# Altium schematic sheet 17 MIPI_CSI_RX.SchDoc: CM4 IO
size 420 x 297 mm; Page Create Date: March  8, 1995; Page Number: 17; Page Size: A3; Comment: radxa_1010; Page Count: 19; RevCode: V1.10; Doc: 17 MIPI_CSI_RX; DsnPath: D:\WMS\黄工\[RC126]CM4_IO_V1.10\[RC126]_V1.10\CM4 IO_V1.10.DSN; SchematicName: CM4 IO V1.10; PageName: 17 MIPI_CSI_RX; PageSize: A3; TopSchematic: True
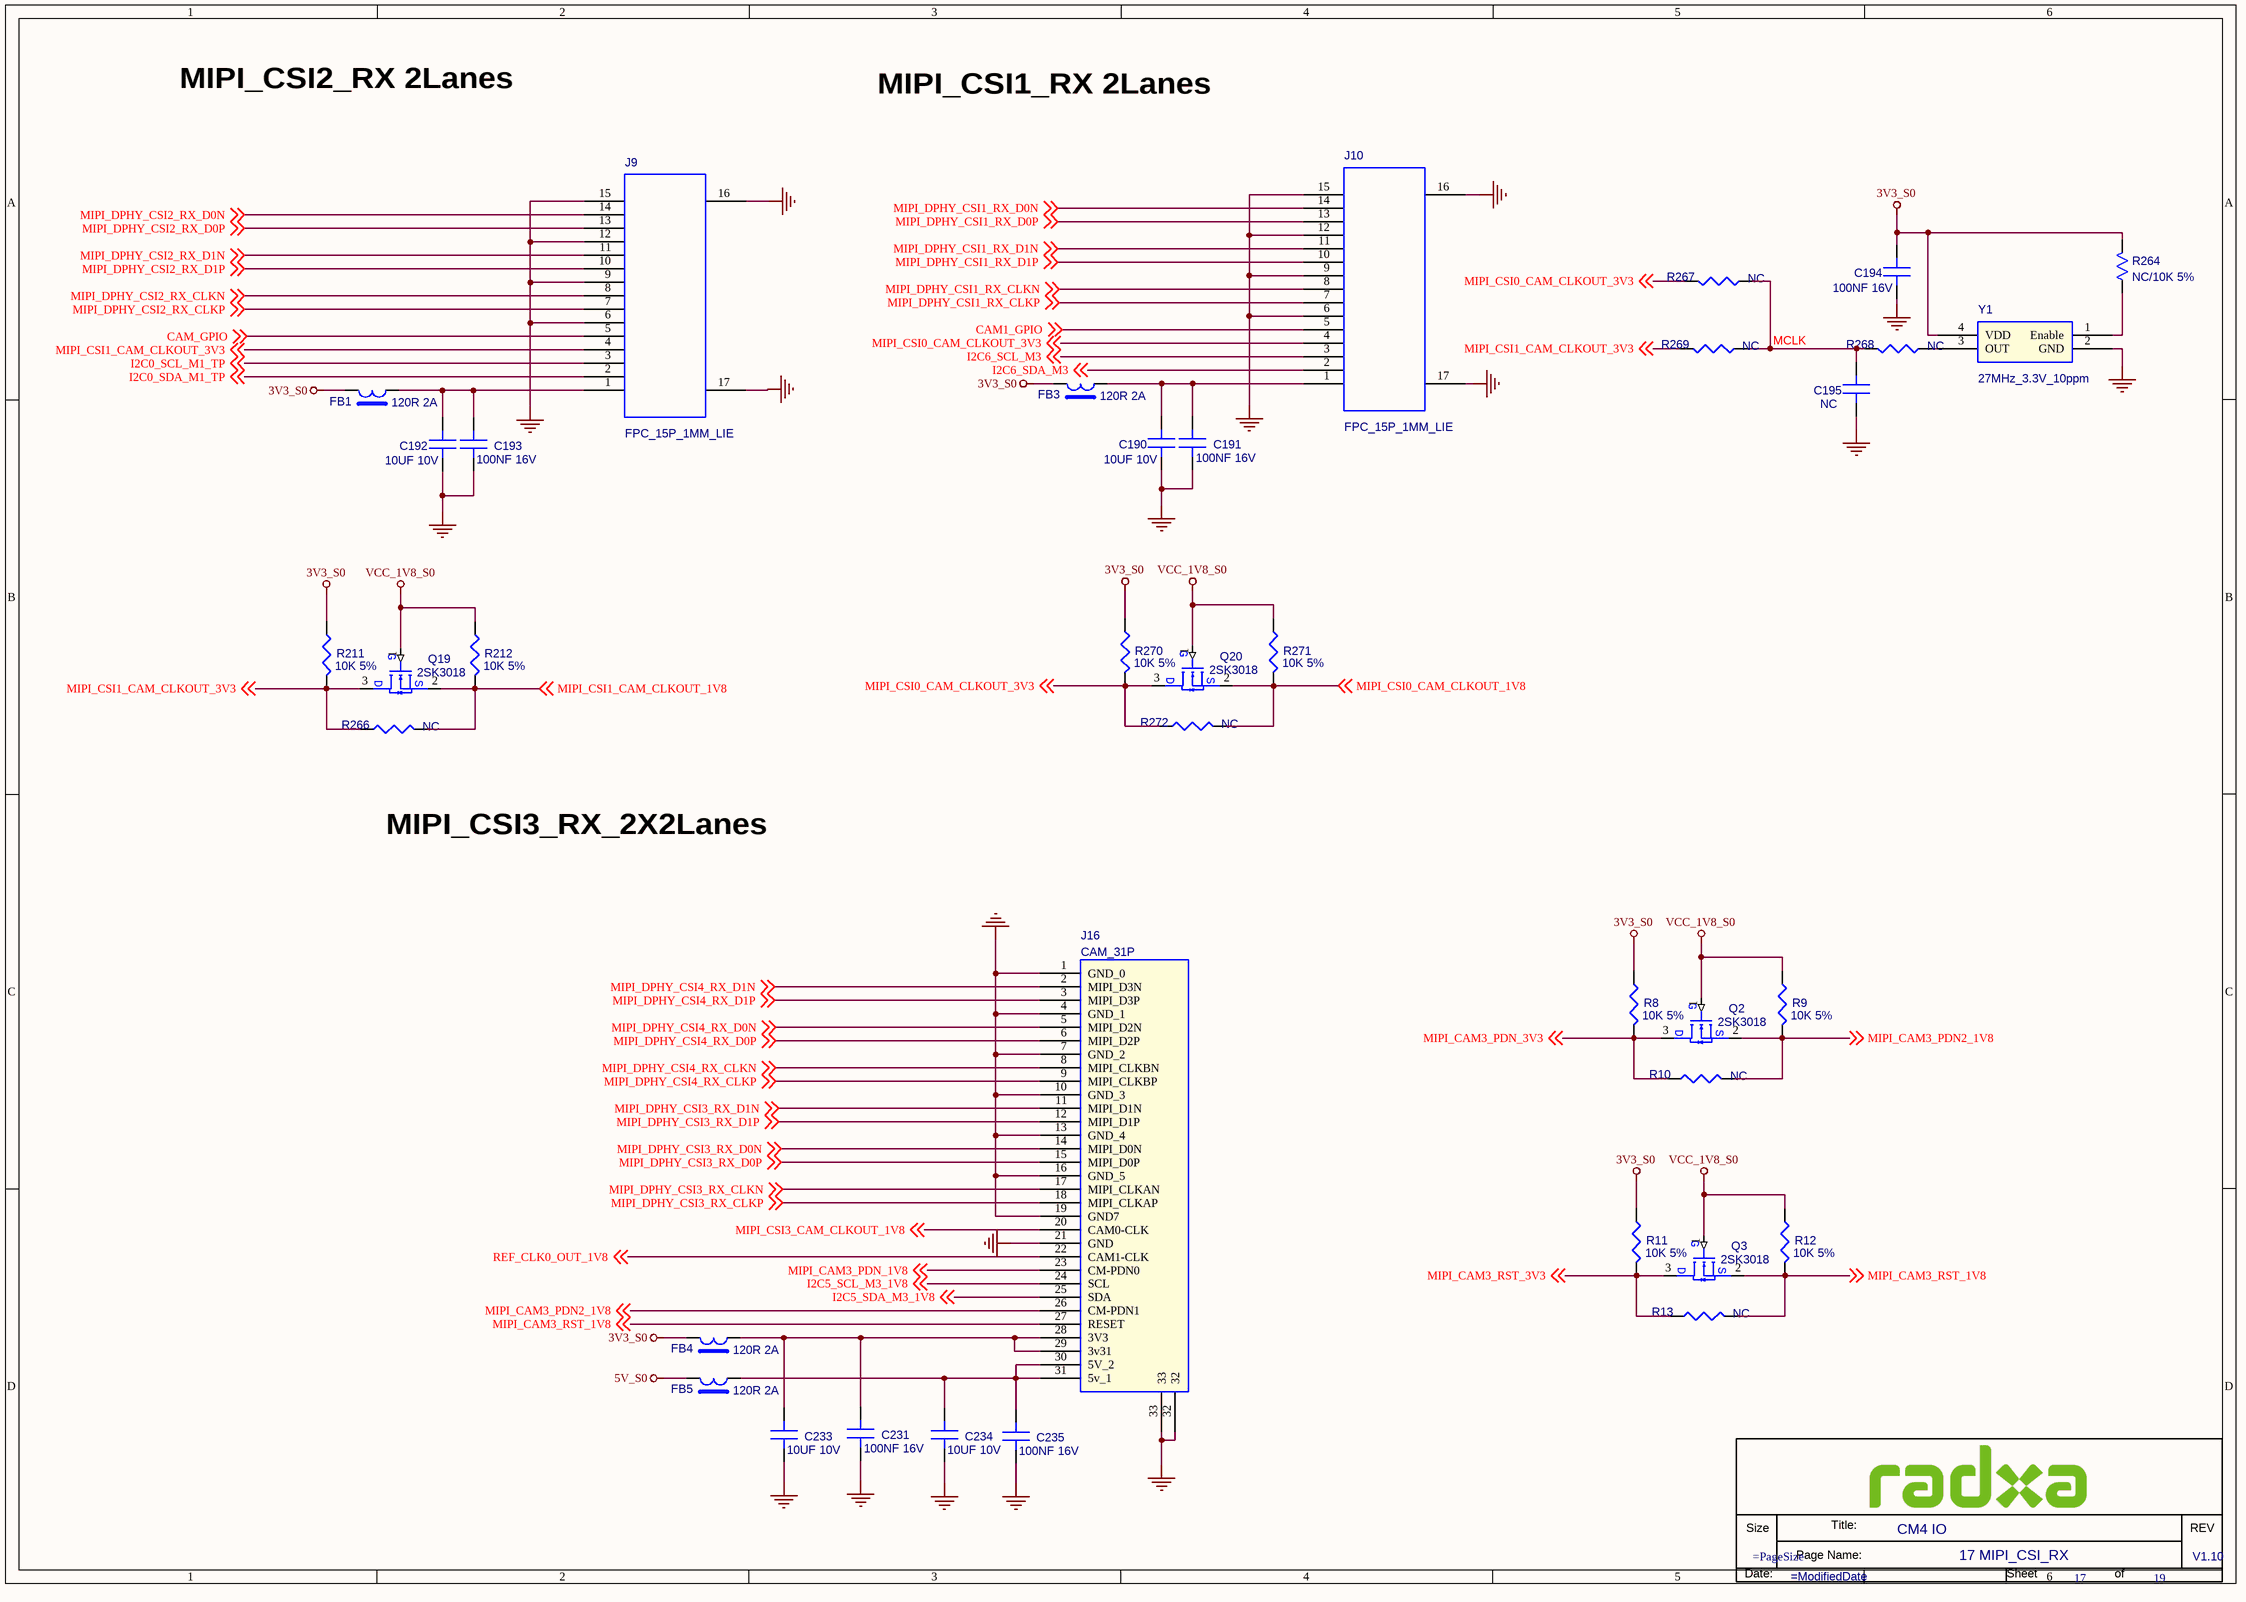
[diagram p0: 17 MIPI_CSI_RX.SchDoc]

## Parts
*  Doc: 17 MIPI_CSI_RX  RevCode: V1.10  Title: CM4 IO  Page Number: 17  Page Count: 19  (hidden comment: radxa_1010)  (graphical)
C190  10UF 10V  [C0402]
C191  100NF 16V  [C0201]
C192  10UF 10V  [C0402]
C193  100NF 16V  [C0201]
C194  100NF 16V  [C0201]
C195  NC  [C0201]
C231  100NF 16V  [C0201]
C233  10UF 10V  [C0402]
C234  10UF 10V  [C0402]
C235  100NF 16V  [C0201]
FB1  120R 2A  [FB0402]
FB3  120R 2A  [FB0402]
FB4  120R 2A  [FB0402]
FB5  120R 2A  [FB0402]
J9  FPC_15P_1MM_LIE  [FPC_15_1D0_LIE]
J10  FPC_15P_1MM_LIE  [FPC_15_1D0_LIE]
J16  CAM_31P  [FPC_31P_0d3_LIE]
Q2  2SK3018  [SOT_323]
Q3  2SK3018  [SOT_323]
Q19  2SK3018  [SOT_323]
Q20  2SK3018  [SOT_323]
R8  10K 5%  [R0402]
R9  10K 5%  [R0402]
R10  NC  [R0402]
R11  10K 5%  [R0402]
R12  10K 5%  [R0402]
R13  NC  [R0402]
R211  10K 5%  [R0402]
R212  10K 5%  [R0402]
R264  NC/10K 5%  [R0201]
R266  NC  [R0402]
R267  NC  [R0402]
R268  NC  [R0402]
R269  NC  [R0402]
R270  10K 5%  [R0402]
R271  10K 5%  [R0402]
R272  NC  [R0402]
Y1  27MHz_3.3V_10ppm  [Y-4-5_08-TXC-7W5]

## Nets
3V3_S0: C194.1 FB1.2 FB3.2 FB4.2 R8.2 R11.2 R211.2 R264.2 R270.2 Y1.4(VDD)
5V_S0: FB5.2
GND: C190.2(B) C191.2(B) C192.2(B) C193.2(B) C194.2 C195.2 C231.2(B) C233.2(B) C234.2(B) C235.2(B) J9.6 J9.9 J9.12 J9.15 J9.16 J9.17 J10.6 J10.9 J10.12 J10.15 J10.16 J10.17 J16.1(GND_0) J16.4(GND_1) J16.7(GND_2) J16.10(GND_3) J16.13(GND_4) J16.16(GND_5) J16.19(GND7) J16.21(GND) J16.32 J16.33 Y1.2(GND)
VCC_1V8_S0: Q2.1(G) Q3.1(G) Q19.1(G) Q20.1(G) R9.2 R12.2 R212.2 R271.2
CAM1_GPIO: J10.5 ; off-sheet CAM1_GPIO
CAM_GPIO: J9.5 ; off-sheet CAM_GPIO
I2C0_SCL_M1_TP: J9.3 ; off-sheet I2C0_SCL_M1_TP
I2C0_SDA_M1_TP: J9.2 ; off-sheet I2C0_SDA_M1_TP
I2C5_SCL_M3_1V8: J16.24(SCL) ; off-sheet I2C5_SCL_M3_1V8
I2C5_SDA_M3_1V8: J16.25(SDA) ; off-sheet I2C5_SDA_M3_1V8
I2C6_SCL_M3: J10.3 ; off-sheet I2C6_SCL_M3
I2C6_SDA_M3: J10.2 ; off-sheet I2C6_SDA_M3
MCLK: C195.1 R267.1 R268.1 R269.1
MIPI_CAM3_PDN2_1V8: J16.26(CM-PDN1) Q2.2(S) R9.1 R10.1 ; off-sheet MIPI_CAM3_PDN2_1V8
MIPI_CAM3_PDN_1V8: J16.23(CM-PDN0) ; off-sheet MIPI_CAM3_PDN_1V8
MIPI_CAM3_PDN_3V3: Q2.3(D) R8.1 R10.2 ; off-sheet MIPI_CAM3_PDN_3V3
MIPI_CAM3_RST_1V8: J16.27(RESET) Q3.2(S) R12.1 R13.1 ; off-sheet MIPI_CAM3_RST_1V8
MIPI_CAM3_RST_3V3: Q3.3(D) R11.1 R13.2 ; off-sheet MIPI_CAM3_RST_3V3
MIPI_CSI0_CAM_CLKOUT_1V8: Q20.2(S) R271.1 R272.1 ; off-sheet MIPI_CSI0_CAM_CLKOUT_1V8
MIPI_CSI0_CAM_CLKOUT_3V3: J10.4 Q20.3(D) R267.2 R270.1 R272.2 ; off-sheet MIPI_CSI0_CAM_CLKOUT_3V3
MIPI_CSI1_CAM_CLKOUT_1V8: Q19.2(S) R212.1 R266.1 ; off-sheet MIPI_CSI1_CAM_CLKOUT_1V8
MIPI_CSI1_CAM_CLKOUT_3V3: J9.4 Q19.3(D) R211.1 R266.2 R269.2 ; off-sheet MIPI_CSI1_CAM_CLKOUT_3V3
MIPI_CSI3_CAM_CLKOUT_1V8: J16.20(CAM0-CLK) ; off-sheet MIPI_CSI3_CAM_CLKOUT_1V8
MIPI_DPHY_CSI1_RX_CLKN: J10.8 ; off-sheet MIPI_DPHY_CSI1_RX_CLKN
MIPI_DPHY_CSI1_RX_CLKP: J10.7 ; off-sheet MIPI_DPHY_CSI1_RX_CLKP
MIPI_DPHY_CSI1_RX_D0N: J10.14 ; off-sheet MIPI_DPHY_CSI1_RX_D0N
MIPI_DPHY_CSI1_RX_D0P: J10.13 ; off-sheet MIPI_DPHY_CSI1_RX_D0P
MIPI_DPHY_CSI1_RX_D1N: J10.11 ; off-sheet MIPI_DPHY_CSI1_RX_D1N
MIPI_DPHY_CSI1_RX_D1P: J10.10 ; off-sheet MIPI_DPHY_CSI1_RX_D1P
MIPI_DPHY_CSI2_RX_CLKN: J9.8 ; off-sheet MIPI_DPHY_CSI2_RX_CLKN
MIPI_DPHY_CSI2_RX_CLKP: J9.7 ; off-sheet MIPI_DPHY_CSI2_RX_CLKP
MIPI_DPHY_CSI2_RX_D0N: J9.14 ; off-sheet MIPI_DPHY_CSI2_RX_D0N
MIPI_DPHY_CSI2_RX_D0P: J9.13 ; off-sheet MIPI_DPHY_CSI2_RX_D0P
MIPI_DPHY_CSI2_RX_D1N: J9.11 ; off-sheet MIPI_DPHY_CSI2_RX_D1N
MIPI_DPHY_CSI2_RX_D1P: J9.10 ; off-sheet MIPI_DPHY_CSI2_RX_D1P
MIPI_DPHY_CSI3_RX_CLKN: J16.17(MIPI_CLKAN) ; off-sheet MIPI_DPHY_CSI3_RX_CLKN
MIPI_DPHY_CSI3_RX_CLKP: J16.18(MIPI_CLKAP) ; off-sheet MIPI_DPHY_CSI3_RX_CLKP
MIPI_DPHY_CSI3_RX_D0N: J16.14(MIPI_D0N) ; off-sheet MIPI_DPHY_CSI3_RX_D0N
MIPI_DPHY_CSI3_RX_D0P: J16.15(MIPI_D0P) ; off-sheet MIPI_DPHY_CSI3_RX_D0P
MIPI_DPHY_CSI3_RX_D1N: J16.11(MIPI_D1N) ; off-sheet MIPI_DPHY_CSI3_RX_D1N
MIPI_DPHY_CSI3_RX_D1P: J16.12(MIPI_D1P) ; off-sheet MIPI_DPHY_CSI3_RX_D1P
MIPI_DPHY_CSI4_RX_CLKN: J16.8(MIPI_CLKBN) ; off-sheet MIPI_DPHY_CSI4_RX_CLKN
MIPI_DPHY_CSI4_RX_CLKP: J16.9(MIPI_CLKBP) ; off-sheet MIPI_DPHY_CSI4_RX_CLKP
MIPI_DPHY_CSI4_RX_D0N: J16.5(MIPI_D2N) ; off-sheet MIPI_DPHY_CSI4_RX_D0N
MIPI_DPHY_CSI4_RX_D0P: J16.6(MIPI_D2P) ; off-sheet MIPI_DPHY_CSI4_RX_D0P
MIPI_DPHY_CSI4_RX_D1N: J16.2(MIPI_D3N) ; off-sheet MIPI_DPHY_CSI4_RX_D1N
MIPI_DPHY_CSI4_RX_D1P: J16.3(MIPI_D3P) ; off-sheet MIPI_DPHY_CSI4_RX_D1P
REF_CLK0_OUT_1V8: J16.22(CAM1-CLK) ; off-sheet REF_CLK0_OUT_1V8
NetC190_1: C190.1(A) C191.1(A) FB3.1 J10.1
NetC192_1: C192.1(A) C193.1(A) FB1.1 J9.1
NetC231_1: C231.1(A) C233.1(A) FB4.1 J16.28(3V3) J16.29(3v31)
NetC234_1: C234.1(A) C235.1(A) FB5.1 J16.30(5V_2) J16.31(5v_1)
NetR264_1: R264.1 Y1.1(Enable)
NetR268_2: R268.2 Y1.3(OUT)

## Notes on the sheet
- MIPI_CSI2_RX 2Lanes
- MIPI_CSI1_RX 2Lanes
- MIPI_CSI3_RX_2X2Lanes
- (in symbol radxa_1010) Size; Title:; REV; Page Name:; Date:; Sheet; of

## Library data of the parts
C190 = C: SMD  0402  10UF  10V  X5R  ±20%  ROHS; PARTS: 1; Part Reference: C190; Part Number: A1C01.00025; OriginalSymbolOrigin: (0,30); PKG_TYPE: CAP2-100-250; LEVEL: STD; PINSWAP: (A,B); Preferred: 6715f349cd0bc5; Value: 10UF 10V; Part Type: 陶瓷电容; PCB Footprint: C0402
C191 = C: SMD  0201  100NF  16V  X5R  ±20%  ROHS; PARTS: 1; Part Reference: C191; Part Number: A1C01.00099; OriginalSymbolOrigin: (0,30); PKG_TYPE: CAP2-100-250; LEVEL: STD; PINSWAP: (A,B); Preferred: 6715f349cd0bc5; Value: 100NF 16V; Part Type: 陶瓷电容; PCB Footprint: C0201
C192 = C: SMD  0402  10UF  10V  X5R  ±20%  ROHS; PARTS: 1; Part Reference: C192; Part Number: A1C01.00025; OriginalSymbolOrigin: (0,30); PKG_TYPE: CAP2-100-250; LEVEL: STD; PINSWAP: (A,B); Preferred: 6715f349cd0bc5; Value: 10UF 10V; Part Type: 陶瓷电容; PCB Footprint: C0402
C193 = C: SMD  0201  100NF  16V  X5R  ±20%  ROHS; PARTS: 1; Part Reference: C193; Part Number: A1C01.00099; OriginalSymbolOrigin: (0,30); PKG_TYPE: CAP2-100-250; LEVEL: STD; PINSWAP: (A,B); Preferred: 6715f349cd0bc5; Value: 100NF 16V; Part Type: 陶瓷电容
C194 = C_Dup1: SMD  0201  100NF  16V  X5R  ±20%  ROHS; PARTS: 1; Part Reference: C194; Part Number: A1C01.00099; OriginalSymbolOrigin: (0,30); PKG_TYPE: CAP2-100-250; LEVEL: STD; PINSWAP: (A,B); Preferred: 6715f349cd0bc5; ROOM: DVDD_MEDIA; Grade: B; Approved: 已承认; Value: 100NF 16V; Part Type: 陶瓷电容; PCB Footprint: C0201
C195 = C_Dup1: SMD  0201  10PF  50V  NPO  ±5%  ROHS; PARTS: 1; Part Reference: C195; Part Number: A1C01.00141; OriginalSymbolOrigin: (0,30); PKG_TYPE: CAP2-100-250; LEVEL: STD; PINSWAP: (A,B); Preferred: 6715f349cd0bc5; Approved: 已承认; Grade: B; ROOM: AN41908; Value: NC; Part Type: 陶瓷电容; PCB Footprint: C0201
C231 = C: SMD  0201  100NF  16V  X5R  ±20%  ROHS; PARTS: 1; Part Reference: C231; Part Number: A1C01.00099; OriginalSymbolOrigin: (0,30); PKG_TYPE: CAP2-100-250; LEVEL: STD; PINSWAP: (A,B); Preferred: 6715f349cd0bc5; Value: 100NF 16V; PCB Footprint: C0201; Part Type: 陶瓷电容
C233 = C: SMD  0402  10UF  10V  X5R  ±20%  ROHS; PARTS: 1; Part Reference: C233; Part Number: A1C01.00025; OriginalSymbolOrigin: (0,30); PKG_TYPE: CAP2-100-250; LEVEL: STD; PINSWAP: (A,B); Preferred: 6715f349cd0bc5; Value: 10UF 10V; PCB Footprint: C0402; Part Type: 陶瓷电容
C234 = C: SMD  0402  10UF  10V  X5R  ±20%  ROHS; PARTS: 1; Part Reference: C234; Part Number: A1C01.00025; OriginalSymbolOrigin: (0,30); PKG_TYPE: CAP2-100-250; LEVEL: STD; PINSWAP: (A,B); Preferred: 6715f349cd0bc5; Value: 10UF 10V; PCB Footprint: C0402; Part Type: 陶瓷电容
C235 = C: SMD  0201  100NF  16V  X5R  ±20%  ROHS; PARTS: 1; Part Reference: C235; Part Number: A1C01.00099; OriginalSymbolOrigin: (0,30); PKG_TYPE: CAP2-100-250; LEVEL: STD; PINSWAP: (A,B); Preferred: 6715f349cd0bc5; Value: 100NF 16V; PCB Footprint: C0201; Part Type: 陶瓷电容
FB1 = BEAD: SMD  0402  FB120R  2A  ±25%  ROHS; Part Reference: FB1; Part Number: A1L09.00004; Preferred: 6715f349cd0bc5; Temp Coeff: -55℃ to +125℃; PCB Footprint: FB0402; Value: 120R 2A; Part Type: 贴片磁珠
FB3 = BEAD: SMD  0402  FB120R  2A  ±25%  ROHS; Part Reference: FB3; Part Number: A1L09.00004; Preferred: 6715f349cd0bc5; Temp Coeff: -55℃ to +125℃; PCB Footprint: FB0402; Value: 120R 2A; Part Type: 贴片磁珠
FB4 = BEAD: SMD  0402  FB120R  2A  ±25%  ROHS; Part Reference: FB4; Part Number: A1L09.00004; Temp Coeff: -55℃ to +125℃; Preferred: 6715f349cd0bc5; PCB Footprint: FB0402; Value: 120R 2A; Part Type: 贴片磁珠
FB5 = BEAD: SMD  0402  FB120R  2A  ±25%  ROHS; Part Reference: FB5; Part Number: A1L09.00004; Preferred: 6715f349cd0bc5; Temp Coeff: -55℃ to +125℃; PCB Footprint: FB0402; Value: 120R 2A; Part Type: 贴片磁珠
J9 = FPC_15P_LIE: SMD  翻盖式下接触  卧式  15PIN  180度  1.0mm脚距  H2.0  FPC-1.0FX-15PWCR-H20  XUNPU(讯普)  ROHS; Part Reference: J9; Part Number: A1J06.00025; OriginalSymbolOrigin: (-150,450); Preferred: 6715f349cd0bc5; Temp Coeff: -40℃ to +85℃; ANGLE: ?; ASSEMBLY: ?; EMI_GROUND_TAB: ?; GENDER: ?; LATCHING: ?; MAX_CURRENT: ?; MAX_VOLTAGE: ?; NV_NAME: ?; NV_PN: ?; PACK_TYPE: ?; PATH: ?; PITCH: ?; PLACEMENT_NOTE: ?; REFLOW: ?; SHIELDED: ?; SHROUDED: ?; SKU: COMMON; Value: FPC_15P_1MM_LIE; Part Type: FPC座; PCB Footprint: FPC_15_1D0_LIE
J10 = FPC_15P_LIE: SMD  翻盖式下接触  卧式  15PIN  180度  1.0mm脚距  H2.0  FPC-1.0FX-15PWCR-H20  XUNPU(讯普)  ROHS; Part Reference: J10; Part Number: A1J06.00025; OriginalSymbolOrigin: (-150,450); Temp Coeff: -40℃ to +85℃; Preferred: 6715f349cd0bc5; ANGLE: ?; ASSEMBLY: ?; EMI_GROUND_TAB: ?; GENDER: ?; LATCHING: ?; MAX_CURRENT: ?; MAX_VOLTAGE: ?; NV_NAME: ?; NV_PN: ?; PACK_TYPE: ?; PATH: ?; PITCH: ?; PLACEMENT_NOTE: ?; REFLOW: ?; SHIELDED: ?; SHROUDED: ?; SKU: COMMON; Value: FPC_15P_1MM_LIE; Part Type: FPC座; PCB Footprint: FPC_15_1D0_LIE
J16 = CAM_31P: SMD  上下接触  卧式  31PIN  0.3mm脚距  后翻盖H1.0  FH35C-31S-0.3SHW(50)  镀金  广濑  ROHS; Part Reference: J16; Part Number: A1J06.00002; PCB Footprint: FPC_31P_0d3_LIE; Value: CAM_31P; Part Type: FPC座
Q2 = MOSFET_NPN: SMD  编带  SOT-323  2SK3018  N沟道  长晶  ROHS; Part Reference: Q2; Part Number: A1D01.00007; Temp Coeff: -55℃ to ＋150℃; Value: 2SK3018; Part Type: 三极管-MOS管; PCB Footprint: SOT_323
Q3 = MOSFET_NPN: SMD  编带  SOT-323  2SK3018  N沟道  长晶  ROHS; Part Reference: Q3; Part Number: A1D01.00007; Temp Coeff: -55℃ to ＋150℃; Value: 2SK3018; Part Type: 三极管-MOS管; PCB Footprint: SOT_323
Q19 = MOSFET_NPN: SMD  编带  SOT-323  2SK3018  N沟道  长晶  ROHS; Part Reference: Q19; Part Number: A1D01.00007; Temp Coeff: -55℃ to ＋150℃; Value: 2SK3018; Part Type: 三极管-MOS管; PCB Footprint: SOT_323
Q20 = MOSFET_NPN: SMD  编带  SOT-323  2SK3018  N沟道  长晶  ROHS; Part Reference: Q20; Part Number: A1D01.00007; Temp Coeff: -55℃ to ＋150℃; Value: 2SK3018; Part Type: 三极管-MOS管; PCB Footprint: SOT_323
R8 = R: SMD  0201  10K  1/20W  ±5%  ROHS; Part Reference: R8; Part Number: A1R01.00012; PCB Footprint: R0201; Preferred: 6715f349cd0bc5; Temp Coeff: -55℃ to +125℃; Value: 10K 5%; Part Type: 贴片电阻
R9 = R: SMD  0201  10K  1/20W  ±5%  ROHS; Part Reference: R9; Part Number: A1R01.00012; PCB Footprint: R0201; Preferred: 6715f349cd0bc5; Temp Coeff: -55℃ to +125℃; Value: 10K 5%; Part Type: 贴片电阻
R10 = R: SMD  0201  0R  1/20W  ±5%  ROHS; Part Reference: R10; Part Number: A1R01.00027; PCB Footprint: R0201; Temp Coeff: -55℃ to +125℃; Preferred: 6715f349cd0bc5; Value: NC; Part Type: 贴片电阻
R11 = R: SMD  0201  10K  1/20W  ±5%  ROHS; Part Reference: R11; Part Number: A1R01.00012; PCB Footprint: R0201; Preferred: 6715f349cd0bc5; Temp Coeff: -55℃ to +125℃; Value: 10K 5%; Part Type: 贴片电阻
R12 = R: SMD  0201  10K  1/20W  ±5%  ROHS; Part Reference: R12; Part Number: A1R01.00012; PCB Footprint: R0201; Preferred: 6715f349cd0bc5; Temp Coeff: -55℃ to +125℃; Value: 10K 5%; Part Type: 贴片电阻
R13 = R: SMD  0201  0R  1/20W  ±5%  ROHS; Part Reference: R13; Part Number: A1R01.00027; PCB Footprint: R0201; Temp Coeff: -55℃ to +125℃; Preferred: 6715f349cd0bc5; Value: NC; Part Type: 贴片电阻
R211 = R: SMD  0201  10K  1/20W  ±5%  ROHS; Part Reference: R211; Part Number: A1R01.00012; PCB Footprint: R0201; Preferred: 6715f349cd0bc5; Temp Coeff: -55℃ to +125℃; Value: 10K 5%; Part Type: 贴片电阻
R212 = R: SMD  0201  10K  1/20W  ±5%  ROHS; Part Reference: R212; Part Number: A1R01.00012; PCB Footprint: R0201; Preferred: 6715f349cd0bc5; Temp Coeff: -55℃ to +125℃; Value: 10K 5%; Part Type: 贴片电阻
R264 = R_Dup1: SMD  0201  10K  1/20W  ±5%  ROHS; PARTS: 1; Part Reference: R264; Part Number: A1R01.00012; LEVEL: STD; PKG_TYPE: 2; PINSWAP: (A,B); OriginalSymbolOrigin: (10,20); ROOM: DC-IRIS; Grade: B; Approved: 已承认; Temp Coeff: -55℃ to +125℃; Preferred: 6715f349cd0bc5; Value: NC/10K 5%; Part Type: 贴片电阻; PCB Footprint: R0201
R266 = R: SMD  0201  0R  1/20W  ±5%  ROHS; Part Reference: R266; Part Number: A1R01.00027; PCB Footprint: R0201; Temp Coeff: -55℃ to +125℃; Preferred: 6715f349cd0bc5; Value: NC; Part Type: 贴片电阻
R267 = R: SMD  0201  0R  1/20W  ±5%  ROHS; Part Reference: R267; Part Number: A1R01.00027; PCB Footprint: R0201; Temp Coeff: -55℃ to +125℃; Preferred: 6715f349cd0bc5; Value: NC; Part Type: 贴片电阻
R268 = R: SMD  0201  0R  1/20W  ±5%  ROHS; Part Reference: R268; Part Number: A1R01.00027; PCB Footprint: R0201; Preferred: 6715f349cd0bc5; Temp Coeff: -55℃ to +125℃; Value: NC; Part Type: 贴片电阻
R269 = R: SMD  0201  0R  1/20W  ±5%  ROHS; Part Reference: R269; Part Number: A1R01.00027; PCB Footprint: R0201; Preferred: 6715f349cd0bc5; Temp Coeff: -55℃ to +125℃; Value: NC; Part Type: 贴片电阻
R270 = R: SMD  0201  10K  1/20W  ±5%  ROHS; Part Reference: R270; Part Number: A1R01.00012; PCB Footprint: R0201; Preferred: 6715f349cd0bc5; Temp Coeff: -55℃ to +125℃; Value: 10K 5%; Part Type: 贴片电阻
R271 = R: SMD  0201  10K  1/20W  ±5%  ROHS; Part Reference: R271; Part Number: A1R01.00012; PCB Footprint: R0201; Preferred: 6715f349cd0bc5; Temp Coeff: -55℃ to +125℃; Value: 10K 5%; Part Type: 贴片电阻
R272 = R: SMD  0201  0R  1/20W  ±5%  ROHS; Part Reference: R272; Part Number: A1R01.00027; PCB Footprint: R0201; Temp Coeff: -55℃ to +125℃; Preferred: 6715f349cd0bc5; Value: NC; Part Type: 贴片电阻
Y1 = OSC_4P_V: SMD  有源  3225  27MHz  3.3V  ±10ppm  晶灏  3N27.000E33YCG  ROHS; Part Reference: Y1; Part Number: A1Y01.00074; Preferred: 6715f349cd0bc5; Temp Coeff: -40℃ to +85℃; PCB Footprint: OSC_SM4_3D2X2D5; Value: 27MHz_3.3V_10ppm; Part Type: 晶振
* = radxa_1010: Page Create Date: March  8, 1995; Page Size: =PageSize; Page Modify Date: =ModifiedDate